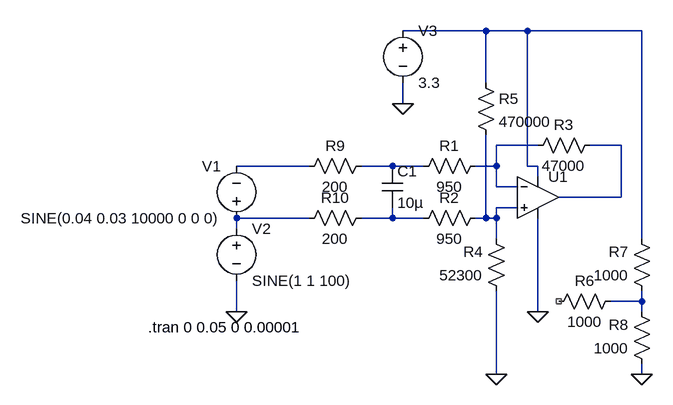
[diagram p0: schematic amplifier.asc]
amplifier.asc, the LTspice schematic file:
Version 4
SHEET 1 880 680
WIRE 80 -80 -48 -80
WIRE 144 -80 80 -80
WIRE 320 -80 144 -80
WIRE 80 0 80 -80
WIRE -48 32 -48 0
WIRE 160 96 96 96
WIRE 288 96 240 96
WIRE -192 128 -304 128
WIRE -64 128 -112 128
WIRE -16 128 -64 128
WIRE 96 128 96 96
WIRE 96 128 64 128
WIRE 144 128 144 -80
WIRE 160 128 144 128
WIRE 160 144 160 128
WIRE 96 160 96 128
WIRE 128 160 96 160
WIRE 288 176 288 96
WIRE 288 176 192 176
WIRE 128 192 96 192
WIRE -192 208 -304 208
WIRE -64 208 -64 192
WIRE -64 208 -112 208
WIRE -16 208 -64 208
WIRE 80 208 80 80
WIRE 80 208 64 208
WIRE 96 208 96 192
WIRE 96 208 80 208
WIRE -304 224 -304 208
WIRE 96 240 96 208
WIRE 320 240 320 -80
WIRE 320 336 320 320
WIRE 320 336 272 336
WIRE -304 352 -304 304
WIRE 160 352 160 208
WIRE 320 352 320 336
WIRE 96 448 96 320
WIRE 320 448 320 432
FLAG -304 352 0
FLAG 160 352 0
FLAG -48 32 0
FLAG 96 448 0
FLAG 320 448 0
SYMBOL res 80 112 R90
WINDOW 0 0 56 VBottom 2
WINDOW 3 32 56 VTop 2
SYMATTR InstName R1
SYMATTR Value 950
SYMBOL res 80 192 R90
WINDOW 0 0 56 VBottom 2
WINDOW 3 32 56 VTop 2
SYMATTR InstName R2
SYMATTR Value 950
SYMBOL res 256 80 R90
WINDOW 0 0 56 VBottom 2
WINDOW 3 32 56 VTop 2
SYMATTR InstName R3
SYMATTR Value 47000
SYMBOL res 112 336 R180
WINDOW 0 36 76 Left 2
WINDOW 3 36 40 Left 2
SYMATTR InstName R4
SYMATTR Value 52300
SYMBOL voltage -304 224 R180
WINDOW 0 24 96 Left 2
WINDOW 3 24 16 Left 2
WINDOW 123 0 0 Left 0
WINDOW 39 0 0 Left 0
SYMATTR InstName V1
SYMATTR Value SINE(0.04 0.03 10000 0 0 0)
SYMBOL OpAmps\\UniversalOpamp2 160 176 R0
SYMATTR InstName U1
SYMBOL voltage -304 208 R0
WINDOW 123 0 0 Left 0
WINDOW 39 0 0 Left 0
SYMATTR InstName V2
SYMATTR Value SINE(1 1 100)
SYMBOL voltage -48 -96 R0
WINDOW 123 0 0 Left 0
WINDOW 39 0 0 Left 0
SYMATTR InstName V3
SYMATTR Value 3.3
SYMBOL res 64 -16 R0
SYMATTR InstName R5
SYMATTR Value 470000
SYMBOL res 288 320 R90
WINDOW 0 0 56 VBottom 2
WINDOW 3 32 56 VTop 2
SYMATTR InstName R6
SYMATTR Value 1000
SYMBOL res 336 336 R180
WINDOW 0 36 76 Left 2
WINDOW 3 36 40 Left 2
SYMATTR InstName R7
SYMATTR Value 1000
SYMBOL res 336 448 R180
WINDOW 0 36 76 Left 2
WINDOW 3 36 40 Left 2
SYMATTR InstName R8
SYMATTR Value 1000
SYMBOL res -96 112 R90
WINDOW 0 0 56 VBottom 2
WINDOW 3 32 56 VTop 2
SYMATTR InstName R9
SYMATTR Value 200
SYMBOL cap -80 128 R0
SYMATTR InstName C1
SYMATTR Value 10µ
SYMBOL res -96 192 R90
WINDOW 0 0 56 VBottom 2
WINDOW 3 32 56 VTop 2
SYMATTR InstName R10
SYMATTR Value 200
TEXT -440 376 Left 2 !.tran 0 0.05 0 0.00001

The netlist it stands for:
* amplifier.asc
R1 N002 N005 950
R2 N006 N008 950
R3 N003 N002 47000
R4 0 N006 52300
V1 N007 N004 SINE(0.04 0.03 10000 0 0 0)
XU1 N006 N002 N001 0 N003 level.2 Avol=1Meg GBW=10Meg Slew=10Meg ilimit=25m rail=0 Vos=0 phimargin=45 en=0 enk=0 in=0 ink=0 Rin=500Meg  ; pins IN+ IN- V+ V- OUT
V2 N007 0 SINE(1 1 100)
V3 N001 0 3.3
R5 N001 N006 470000
R6 N009 NC_01 1000
R7 N009 N001 1000
R8 0 N009 1000
R9 N005 N004 200
C1 N005 N008 10µ
R10 N008 N007 200
.tran 0 0.05 0 0.00001
.lib UniversalOpamps2.sub
.backanno
.end